# Altium schematic sheet SCH_RELAY.SchDoc
size A3; SheetNumber: 5; SheetTotal: 10
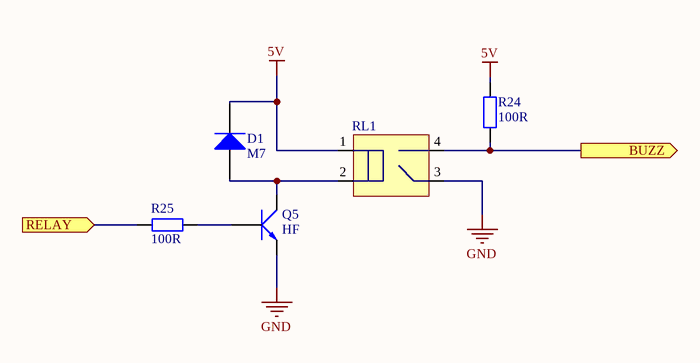
[diagram p0: SCH_RELAY.SchDoc]

## Parts
D1  M7  [DIODE SMA]
Q5  HF  [SOT23]
R24  100R  [tro smd 0603]
R25  100R  [tro smd 0805]
RL1  (no value)  [Relay 4 chan HF46F]

## Ports
BUZZ (out), RELAY (in)

## Nets
5V: D1.2(K) R24.2 RL1.1
GND: Q5.2(E) RL1.3(AC/DC)
BUZZ: R24.1 RL1.4(AC/DC) ; port BUZZ
RELAY: R25.1 ; port RELAY
NetD1_1: D1.1(A) Q5.3(C) RL1.2
NetQ5_1: Q5.1(B) R25.2

## Library data of the parts
D1 = Diode M7 ( 4007 ): Dán; Don_Vi: Con; Ten_Linh_Kien: Diode M7 1N4007 SMD 1A 1000V; Ma_Hang: MH000944; Chung_Loai: Dán; Ghi_Chu: *
Q5 = C1815 HF SMD: NPN transistor; Value: C9014
R24 = Tro 0603 5% 100R: Dán; Don_Vi: Con; So_Chan: 2; Ten_Linh_Kien: Trở 0603 5% 100R; Ma_Hang: MH006315; Chung_Loai: Dán; Kieu_Chan: *
R25 = Tro 0805 5% 100R: Dán; Don_Vi: Con; So_Chan: 2; Ten_Linh_Kien: Trở 0805 5% 100R; Ma_Hang: MH005251; Chung_Loai: Dán; Kieu_Chan: *
RL1 = Relay 4 chan HF46F: Ten: Relay 5V5A HF46F-G 5-HS1; Ma_Hang: MH003879